# EAGLE design Motor_Driver (EAGLE 9.6.2)
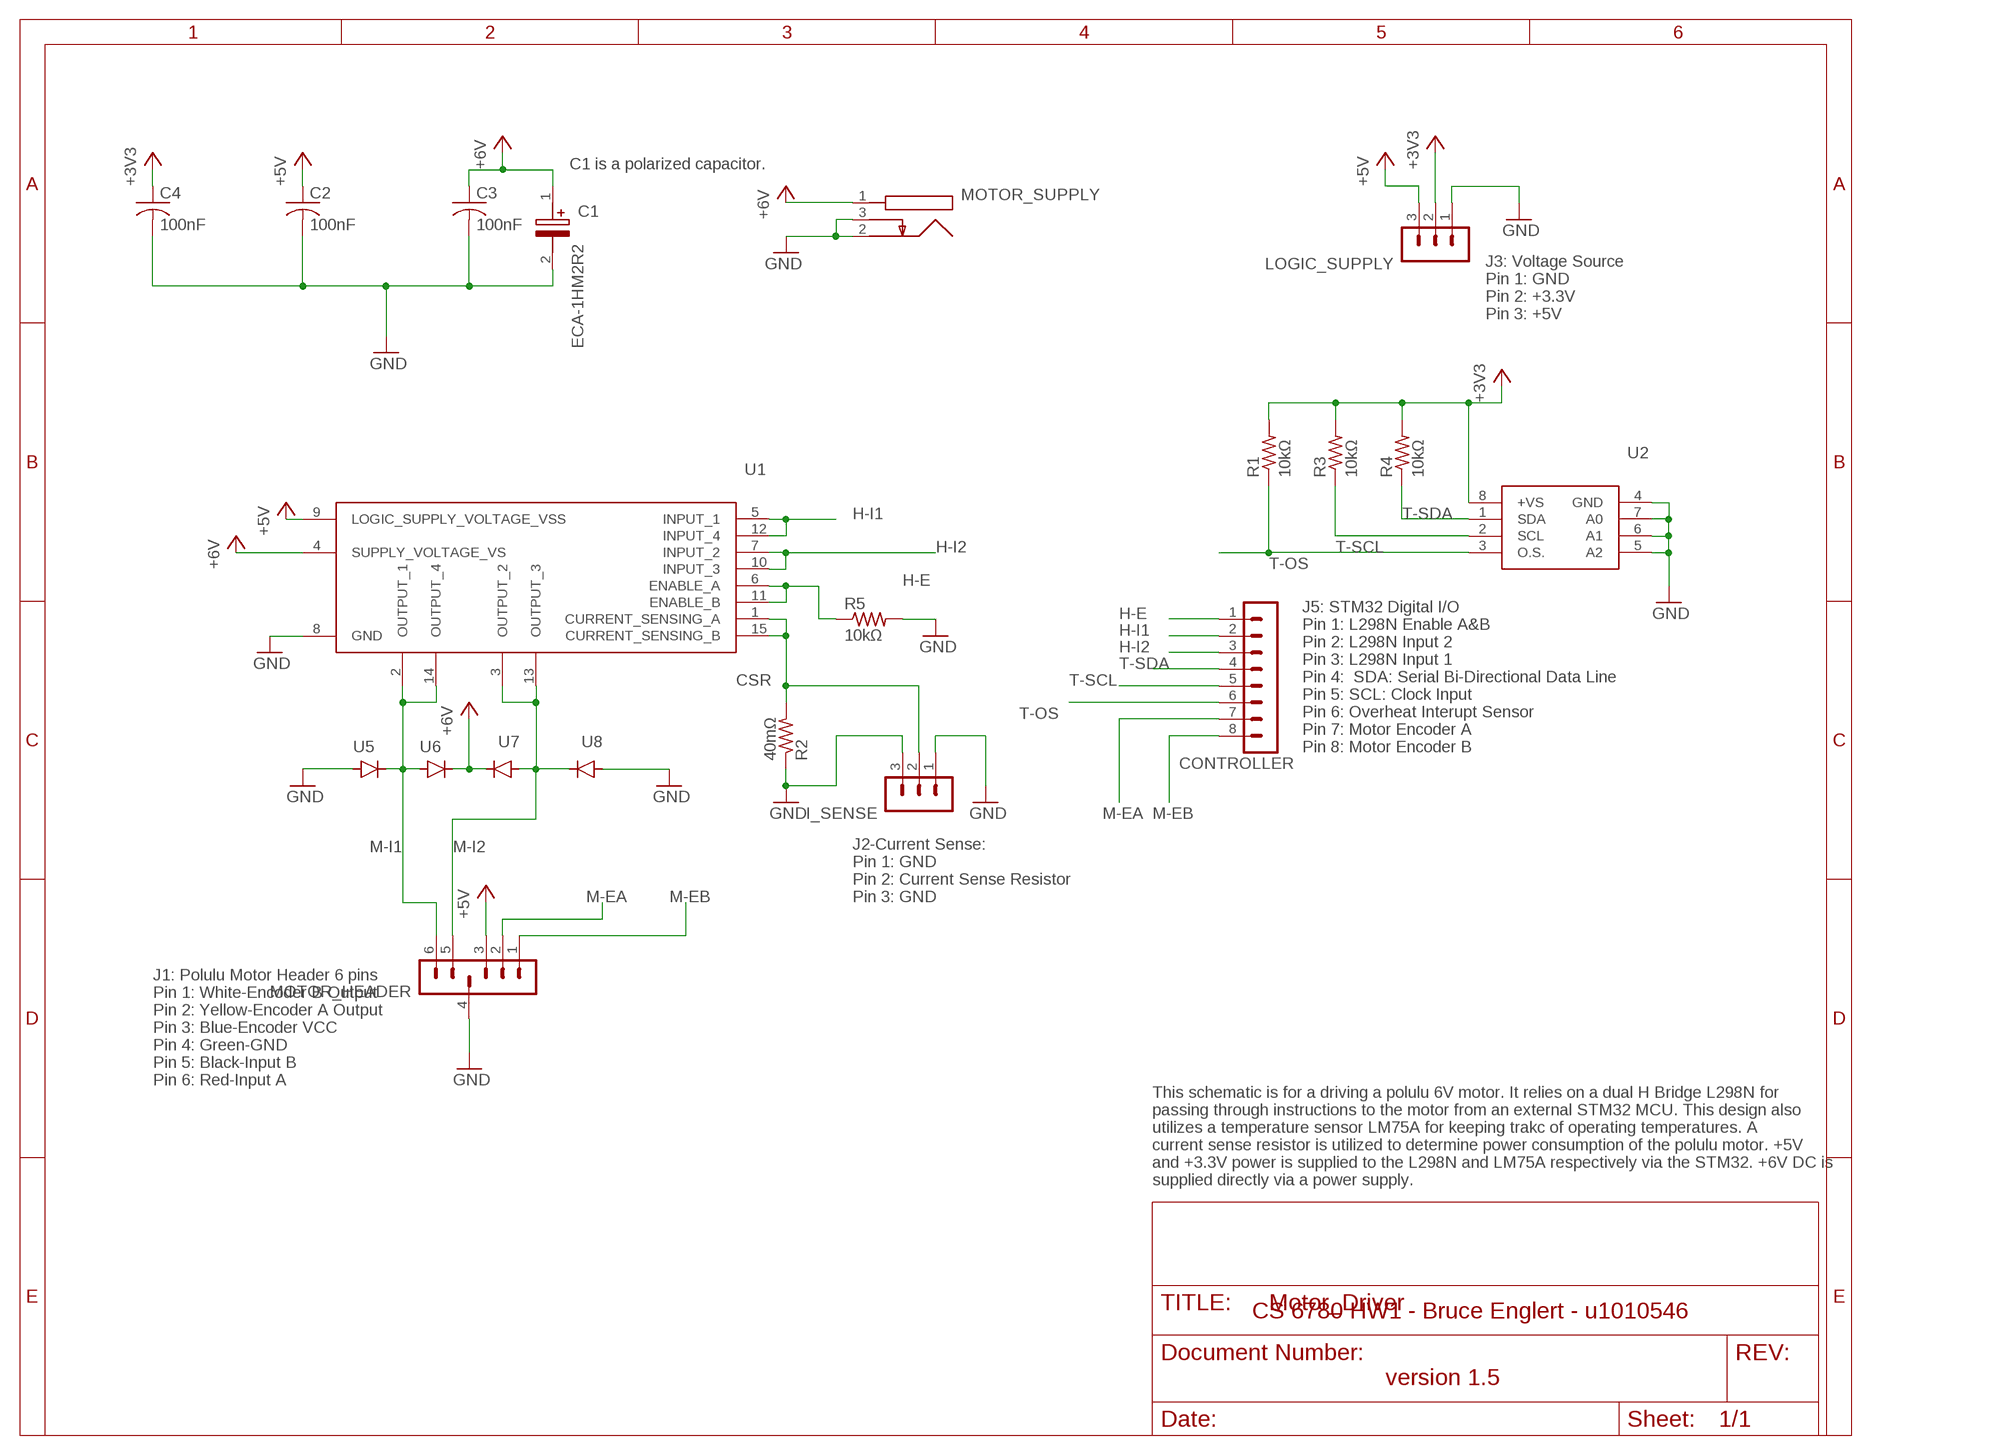
[diagram p0: schematic, sheet 1]

## Parts
C1  ECA-1HM2R2  [CAPPRD200W55D500H1200]
C2  100nF  C-USC1206  [C1206]
C3  100nF  C-USC1206  [C1206]
C4  100nF  C-USC1206  [C1206]
CONTROLLER  MA08-1  [MA08-1]
I_SENSE  CURRENT_SENSE  [MA03-1]
LOGIC_SUPPLY  VOLTAGE_SOURCE  [MA03-1]
MOTOR_HEADER  MA06-1  [MA06-1]
MOTOR_SUPPLY  SUPPLY_JACK  [CONSOCJ2155]
R1  10kΩ  R-US_R1206  [R1206]
R2  40mΩ  R-US_R1206  [R1206]
R3  10kΩ  R-US_R1206  [R1206]
R4  10kΩ  R-US_R1206  [R1206]
R5  10kΩ  R-US_R1206  [R1206]
U1  L298N  [TO127P500X2020X2210-15P]
U2  LM75A  [SOIC127P600X175-8N]
U5  GF1  [SMA-DO214AC]
U6  GF1  [SMA-DO214AC]
U7  GF1  [SMA-DO214AC]
U8  GF1  [SMA-DO214AC]

## Nets
+3V3: C4.1 LOGIC_SUPPLY.2 R1.2 R3.2 R4.2 U2.8(+VS)
+5V: C2.1 LOGIC_SUPPLY.3 MOTOR_HEADER.3 U1.9(LOGIC_SUPPLY_VOLTAGE_VSS)
+6V: C1.1(+) C3.1 MOTOR_SUPPLY.1 U1.4(SUPPLY_VOLTAGE_VS) U6.K(C) U7.K(C)
CSR: I_SENSE.2 R2.2 U1.1(CURRENT_SENSING_A) U1.15(CURRENT_SENSING_B)
GND: C1.2(-) C2.2 C3.2 C4.2 I_SENSE.1 I_SENSE.3 LOGIC_SUPPLY.1 MOTOR_HEADER.4 MOTOR_SUPPLY.2 MOTOR_SUPPLY.3 R2.1 R5.2 U1.8(GND) U2.4(GND) U2.5(A2) U2.6(A1) U2.7(A0) U5.A U8.A
H-E: CONTROLLER.1 R5.1 U1.6(ENABLE_A) U1.11(ENABLE_B)
H-I1: CONTROLLER.2 U1.5(INPUT_1) U1.12(INPUT_4)
H-I2: CONTROLLER.3 U1.7(INPUT_2) U1.10(INPUT_3)
M-EA: CONTROLLER.7 MOTOR_HEADER.2
M-EB: CONTROLLER.8 MOTOR_HEADER.1
M-I1: MOTOR_HEADER.6 U1.2(OUTPUT_1) U1.14(OUTPUT_4) U5.K(C) U6.A
M-I2: MOTOR_HEADER.5 U1.3(OUTPUT_2) U1.13(OUTPUT_3) U7.A U8.K(C)
T-OS: CONTROLLER.6 R1.1 U2.3(O.S.)
T-SCL: CONTROLLER.5 R3.1 U2.2(SCL)
T-SDA: CONTROLLER.4 R4.1 U2.1(SDA)

## Notes on the sheet
- C1 is a polarized capacitor.
- J3: Voltage Source
  Pin 1: GND
  Pin 2: +3.3V
  Pin 3: +5V
- J5: STM32 Digital I/O
  Pin 1: L298N Enable A&B
  Pin 2: L298N Input 2
  Pin 3: L298N Input 1
  Pin 4:  SDA: Serial Bi-Directional Data Line 
  Pin 5: SCL: Clock Input
  Pin 6: Overheat Interupt Sensor
  Pin 7: Motor Encoder A 
  Pin 8: Motor Encoder B
- J2-Current Sense:
  Pin 1: GND
  Pin 2: Current Sense Resistor
  Pin 3: GND
- J1: Polulu Motor Header 6 pins
  Pin 1: White-Encoder B Output
  Pin 2: Yellow-Encoder A Output
  Pin 3: Blue-Encoder VCC
  Pin 4: Green-GND
  Pin 5: Black-Input B
  Pin 6: Red-Input A
- This schematic is for a driving a polulu 6V motor. It relies on a dual H Bridge L298N for 
  passing through instructions to the motor from an external STM32 MCU. This design also 
  utilizes a temperature sensor LM75A for keeping trakc of operating temperatures. A 
  current sense resistor is utilized to determine power consumption of the polulu motor. +5V 
  and +3.3V power is supplied to the L298N and LM75A respectively via the STM32. +6V DC is 
  supplied directly via a power supply.
- CS 6780 HW1 - Bruce Englert - u1010546
- version 1.5

## Library data of the parts
C1 = SamacSys_Parts:ECA-1HM2R2: PANASONIC - ECA-1HM2R2 - Electrolytic Capacitor, 2.2 F, 50 V, M Series, +/- 20%, Radial Leaded, 5 mm Source: Datasheet <http://industrial.panasonic.com/cdbs/www-data/pdf/RDF0000/ABA0000C1218.pdf>; ARROW_PART_NUMBER: ECA-1HM2R2; ARROW_PRICE-STOCK: https://www.arrow.com/en/products/eca-1hm2r2/panasonic; DESCRIPTION: PANASONIC - ECA-1HM2R2 - Electrolytic Capacitor, 2.2 F, 50 V, M Series, +/- 20%, Radial Leaded, 5 mm; HEIGHT: 12mm; MANUFACTURER_NAME: Panasonic; MANUFACTURER_PART_NUMBER: ECA-1HM2R2; MOUSER_PART_NUMBER: 667-ECA-1HM2R2; MOUSER_PRICE-STOCK: https://www.mouser.co.uk/ProductDetail/Panasonic/ECA-1HM2R2/?qs=TaIhzdgpGpXERrZmWR%252BHtw%3D%3D
C2-C4 = rcl:C-US: CAPACITOR, American symbol; SPICEPREFIX: C
CONTROLLER = Bruce_v2:MA08-1: PIN HEADER; OC_FARNELL: unknown; OC_NEWARK: unknown
I_SENSE = Bruce_v2:CURRENT_SENSE: PIN HEADER; OC_FARNELL: unknown; OC_NEWARK: unknown
LOGIC_SUPPLY = Bruce_v2:VOLTAGE_SOURCE: PIN HEADER; OC_FARNELL: unknown; OC_NEWARK: unknown
MOTOR_HEADER = Bruce_v2:MA06-1: PIN HEADER; OC_FARNELL: unknown; OC_NEWARK: unknown
MOTOR_SUPPLY = Bruce_v2:SUPPLY_JACK: DC Power Connectors Power Jack/Connector 2.1mm x 5.5mm Source: Datasheet <http://www.produktinfo.conrad.com/datenblaetter/1500000-1599999/001582350-da-01-en-DC_EINBAUBUCHSE__SCHALTER_GESCHLOSSEN.pdf>; DESCRIPTION: DC Power Connectors Power Jack/Connector 2.1mm x 5.5mm; HEIGHT: 11mm; MANUFACTURER_NAME: Gravitech; MANUFACTURER_PART_NUMBER: CON-SOCJ-2155; MOUSER_PART_NUMBER: 992-CON-SOCJ-2155; MOUSER_PRICE-STOCK: https://www.mouser.co.uk/ProductDetail/Gravitech/CON-SOCJ-2155/?qs=fkzBJ5HM%252BdCcpvFQyQZHtA%3D%3D
R1-R5 = rcl:R-US_: RESISTOR, American symbol; SPICEPREFIX: R
U1 = Bruce_v2:L298N: L298N, Full Bridge Motor Driver, 3A Dual Full Bridge Motor Driver,, 25W 4.8 46 V, 15-Pin MULTIWATT 15 Source: Datasheet <http://www.st.com/web/en/resource/technical/document/datasheet/CD00000240.pdf>; ARROW_PART_NUMBER: L298N; ARROW_PRICE-STOCK: https://www.arrow.com/en/products/l298n/stmicroelectronics; DESCRIPTION: L298N, Full Bridge Motor Driver, 3A Dual Full Bridge Motor Driver,, 25W 4.8 46 V, 15-Pin MULTIWATT 15; HEIGHT: 5mm; MANUFACTURER_NAME: STMicroelectronics; MANUFACTURER_PART_NUMBER: L298N; MOUSER_PART_NUMBER: 511-L298; MOUSER_PRICE-STOCK: https://www.mouser.co.uk/ProductDetail/STMicroelectronics/L298N?qs=gr8Zi5OG3Mj6jDtNclcF9Q%3D%3D
U2 = Bruce_v2:LM75A: ±2°C, 2.7V to 5.5V industry standard temperature sensor with I2C/SMBus interface Source: Datasheet <http://www.ti.com/lit/gpn/lm75a>; ARROW_PART_NUMBER: LM75AIMX/NOPB; ARROW_PRICE-STOCK: https://www.arrow.com/en/products/lm75aimxnopb/texas-instruments; DESCRIPTION: &plusmn;2&deg;C, 2.7V to 5.5V industry standard temperature sensor with I2C/SMBus interface; HEIGHT: 1.75mm; MANUFACTURER_NAME: Texas Instruments; MANUFACTURER_PART_NUMBER: LM75AIMX/NOPB; MOUSER_PART_NUMBER: 926-LM75AIMX/NOPB; MOUSER_PRICE-STOCK: https://www.mouser.co.uk/ProductDetail/Texas-Instruments/LM75AIMX-NOPB/?qs=QbsRYf82W3HsegGIvzKpPg%3D%3D
U5-U8 = Bruce_v2:GF1: DIODE

## Board
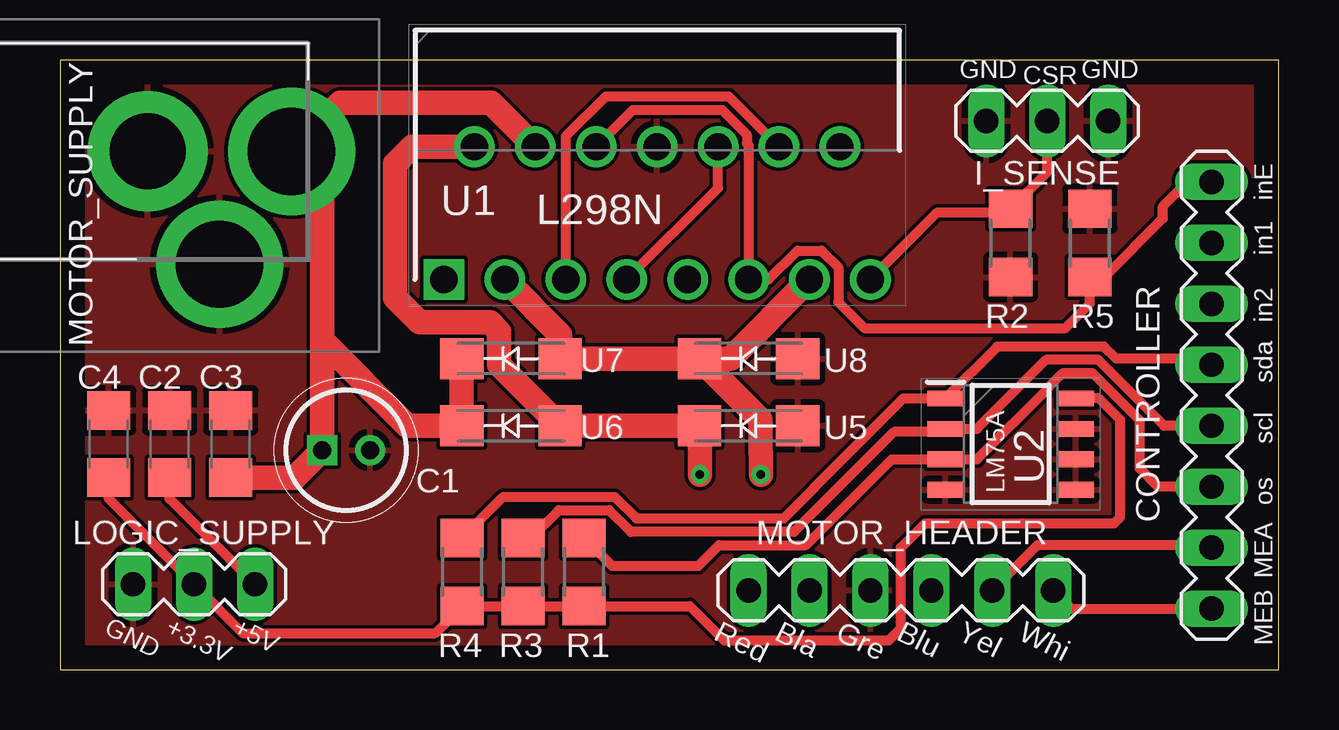
[diagram p1: board, top side]
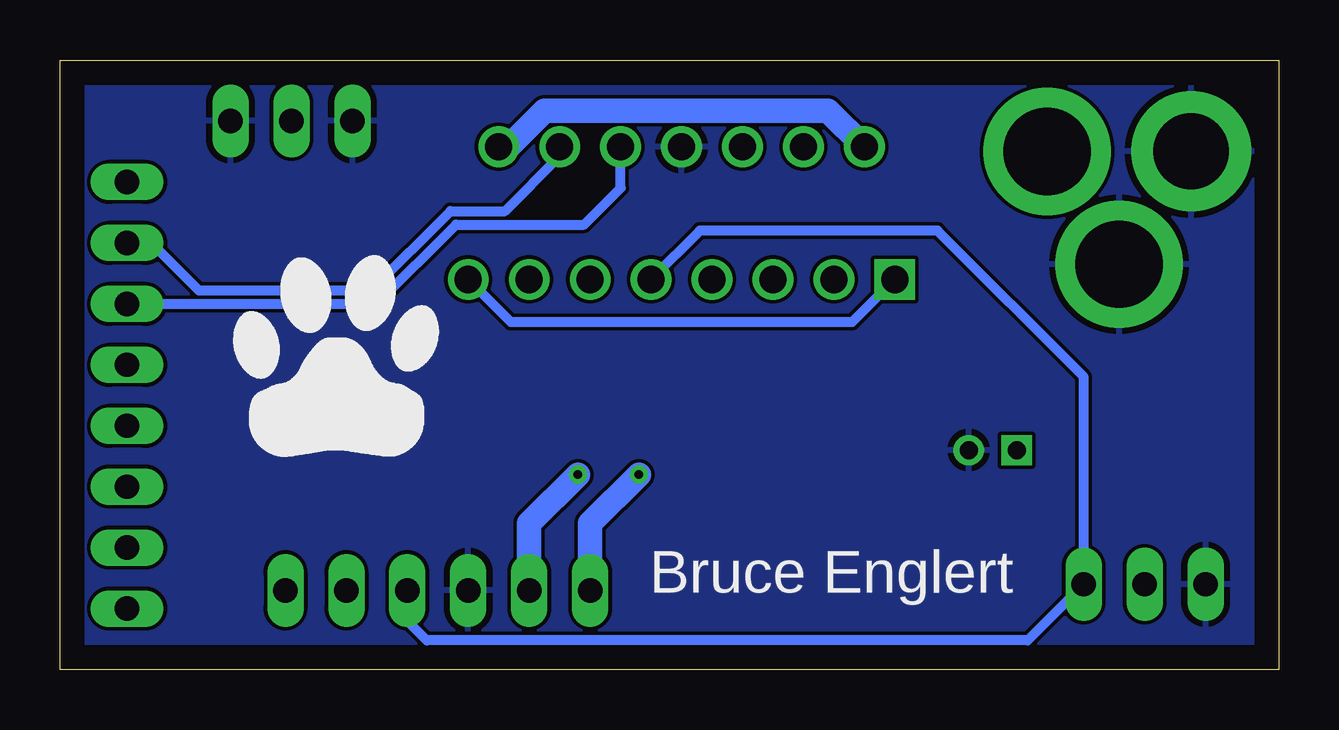
[diagram p2: board, bottom side, seen from below]

Size 50.8 x 25.4 mm. Coordinates in mm from the lower left corner, seen from the top.
Outline: 0,0 50.8,0 50.8,25.4 0,25.4 0,0
Copper layers (1*16): Top 0.035mm / dielectric 1.5mm / Bottom 0.035mm
Design rules "default": minimum track width 6mil, minimum drill 0.35mm, track to track 6mil, track to pad 6mil, pad to pad 6mil, via to via 6mil, smd to smd 6mil, copper to edge 40mil, drill to drill 6mil, minimum pad ring 10mil, minimum via ring 8mil, stop-mask expansion 4mil, vias tented up to drill 0mil, thermal gap 10mil

### Footprints (pad centres in the part's own frame; a part is rotated, then mirrored left to right if it is on the bottom)
CAPPRD200W55D500H1200 = drill 0.75 pad 1.15 square: 1 0,0 | drill 0.75 pad 1.15: 2 2,0
C1206 = smd 1.6 x 1.8: 1 -1.4,0; 2 1.4,0
MA08-1 = drill 1.016 long: 1 -8.89,0; 2 -6.35,0; 3 -3.81,0; 4 -1.27,0; 5 1.27,0; 6 3.81,0; 7 6.35,0; 8 8.89,0
MA03-1 = drill 1.016 long: 1 -2.54,0; 2 0,0; 3 2.54,0
MA06-1 = drill 1.016 long: 1 -6.35,0; 2 -3.81,0; 3 -1.27,0; 4 1.27,0; 5 3.81,0; 6 6.35,0
CONSOCJ2155 = drill 3.64 pad 5.3: 1 0,0; 3 -3,-4.7 | drill 3.162 pad 5: 2 -6,0
R1206 = smd 1.6 x 1.803: 1 -1.422,0; 2 1.422,0
TO127P500X2020X2210-15P = drill 1.13 pad 1.695 square: 1 0,0 | drill 1.13 pad 1.695: 2 1.27,5.53; 3 2.54,0; 4 3.81,5.53; 5 5.08,0; 6 6.35,5.53; 7 7.62,0; 8 8.89,5.53; 9 10.16,0; 10 11.43,5.53; 11 12.7,0; 12 13.97,5.53; 13 15.24,0; 14 16.51,5.53; 15 17.78,0
SOIC127P600X175-8N = smd 1.528 x 0.65: 1 -2.711,1.905; 2 -2.711,0.635; 3 -2.711,-0.635; 4 -2.711,-1.905; 5 2.711,-1.905; 6 2.711,-0.635; 7 2.711,0.635; 8 2.711,1.905
SMA-DO214AC = smd 1.8 x 1.7: A -2.05,0; K 2.05,0

### Placement (x,y rotation side)
C1  10.92,9.14 0 top
C2  4.57,9.4 90 top
C3  7.11,9.4 90 top
C4  2.03,9.4 90 top
CONTROLLER  48.01,11.43 270 top
I_SENSE  41.15,22.86 0 top
LOGIC_SUPPLY  5.59,3.56 0 top
MOTOR_HEADER  35.05,3.3 180 top
MOTOR_SUPPLY  9.65,21.59 0 top
R1  21.84,4.06 270 top
R2  39.62,17.78 90 top
R3  19.3,4.06 270 top
R4  16.76,4.06 270 top
R5  42.93,17.78 90 top
U1  16,16.26 0 top
U2  39.62,9.4 0 top
U5  28.7,10.16 180 top
U6  18.8,10.16 180 top
U7  18.8,12.95 180 top
U8  28.7,12.95 180 top

### Tracks (layer width: path | path; a pad name or v marks a point on that pad's centre or on a via)
+3V3
  Top 0.406: C4.1 2.03,7.11 LOGIC_SUPPLY.2 7.62,1.52 15.65,1.52 R4.2 R3.2 R1.2 26.26,2.64 27.68,1.22 34.54,1.22 35.05,1.73 35.05,5.08 36.07,6.1 43.94,6.1 44.2,6.35 44.2,10.41 43.31,11.3 U2.8
+5V
  Top 0.406: LOGIC_SUPPLY.3 4.57,7.11 C2.1
  Bottom 0.406: MOTOR_HEADER.3 36.32,2.03 35.51,1.22 10.46,1.22 LOGIC_SUPPLY.3 8.13,12.19 14.22,18.29 24.13,18.29 U1.9
+6V
  Top 1.016: U1.4 17.98,23.62 11.68,23.62 MOTOR_SUPPLY.1 10.92,20.32 10.92,13.72 | 10.92,13.72 C1.1 9.78,8 C3.1 | U7.K U6.K 14.48,10.16 10.92,13.72
CSR
  Top 0.406: U1.15 36.58,19.05 39.47,19.05 R2.2 41.15,20.73 I_SENSE.2
  Bottom 0.406: U1.1 17.78,14.48 32,14.48 U1.15
GND
  pour Bottom: 0,0 50.8,0 50.8,25.4 0,25.4
  pour Top: 0,0 0,25.4 50.8,25.4 50.8,0
H-E
  Top 0.406: U1.6 23.88,23.32 27.6,23.32 28.64,22.28 28.64,21.91 28.7,21.84 U1.11 29.54,16.26 30.74,17.46 31.74,17.46 32.45,16.75 32.45,15.31 33.53,14.22 41.91,14.22 42.93,15.24 R5.1 43.54,16.36 45.97,18.8 45.97,19.3 46.99,20.32 CONTROLLER.1
H-I1
  Top 0.406: U1.12 27.88,23.88 22.74,23.88 21.08,22.22 U1.5
  Bottom 0.406: U1.12 29.97,21.39 32.26,19.1 34.52,19.1 37.82,15.8 45.01,15.8 46.99,17.78 CONTROLLER.2
H-I2
  Top 0.406: U1.7 27.43,20.07 U1.10
  Bottom 0.406: U1.10 27.43,20.07 28.96,18.54 34.29,18.54 37.59,15.24 CONTROLLER.3
M-EA
  Top 0.406: CONTROLLER.7 47.9,5.18 40.74,5.18 MOTOR_HEADER.2
M-EB
  Top 0.406: MOTOR_HEADER.1 42.16,2.54 CONTROLLER.8
M-I1  (via drill 0.35)
  Top 1.016: U1.2 14.67,21.79 13.97,21.08 13.97,15.49 15,14.46 17.92,14.46 18.31,14.08 18.31,12.7 U6.A U5.K 26.67,10.14 v26.67,8.13
  Bottom 1.016: U1.14 32.1,21.79 30.6,23.29 18.78,23.29 U1.2 | v26.67,8.13 28.7,6.1 MOTOR_HEADER.6
M-I2  (via drill 0.35)
  Top 1.016: U1.3 20.85,13.95 U7.A U8.K | U1.13 27.94,12.95 U8.K | U8.K 29.19,10.41 29.19,9.04 29.21,9.02 v29.21,8.13
  Bottom 1.016: v29.21,8.13 31.24,6.1 MOTOR_HEADER.5
T-OS
  Top 0.406: R1.1 23.01,4.32 26.61,4.32 27.48,5.18 31.09,5.18 34.67,8.76 U2.3 38.23,8.76 41.22,11.75 41.22,11.78 41.78,12.34 43.06,12.34 45.01,10.39 45.01,8.38 45.77,7.62 CONTROLLER.6
T-SCL
  Top 0.406: R3.1 19.64,5.49 20.8,6.64 22.89,6.64 23.79,5.74 30.6,5.74 34.77,9.91 36.79,9.91 U2.2 38.23,10.03 41.1,12.9 43.29,12.9 46.03,10.16 CONTROLLER.5
T-SDA
  Top 0.406: R4.1 18.48,7.2 23.12,7.2 24.03,6.3 30.18,6.3 31.45,7.57 31.45,7.6 35.15,11.3 U2.1 39.07,13.46 43.52,13.46 44.03,12.95 47.75,12.95 CONTROLLER.4

### Text on the board
tPlace: GND | CSR | GND | L298N | inE | in1 | in2 | sda | scl | LM75A | os | MEA | GND | +3.3V | +5V | Red | Bla | Gre | Blu | Yel | Whi | MEB
bPlace: Bruce Englert
bValues: Bruce Englert